# Altium schematic sheet AI_XiaoZhi_WIFI.SchDoc
size A3; SheetNumber: 1; SheetTotal: 1
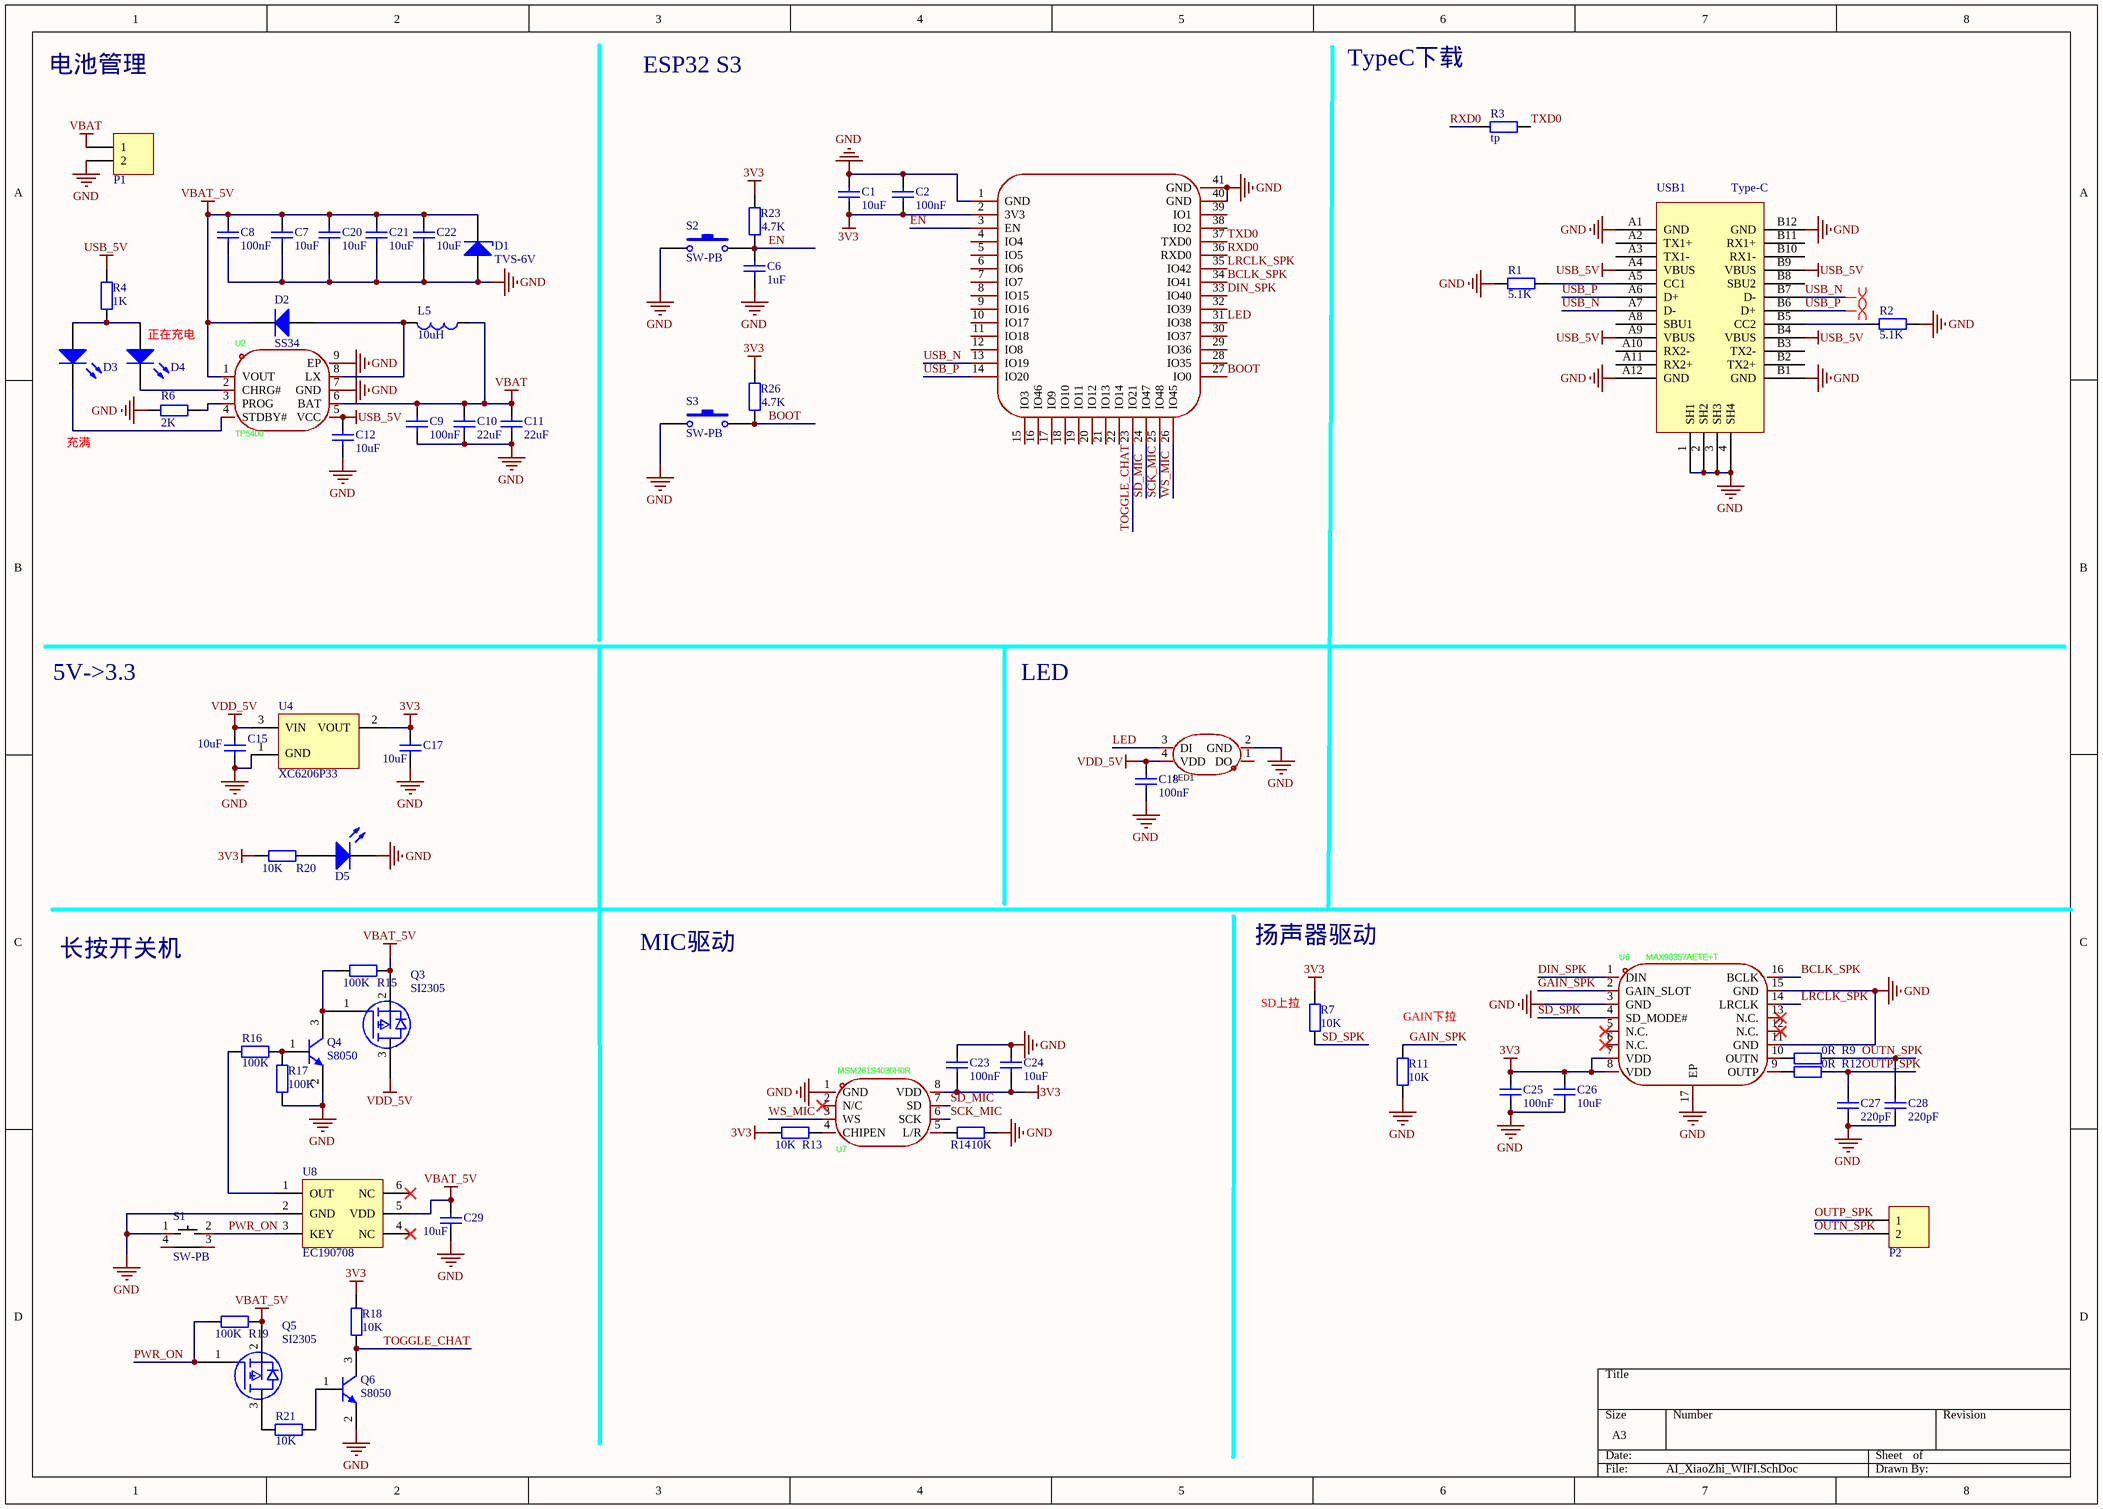
[diagram p0: AI_XiaoZhi_WIFI.SchDoc]

## Parts
C1  value 10uF  [0603-C]  (hidden comment: CAP)
C2  value 100nF  [0603-C]  (hidden comment: CAP)
C6  value 1uF  [0603-C]  (hidden comment: CAP)
C7  value 10uF  [0603-C]  (hidden comment: CAP)
C8  value 100nF  [0603-C]  (hidden comment: CAP)
C9  value 100nF  [0603-C]  (hidden comment: CAP)
C10  value 22uF  [0603-C]  (hidden comment: CAP)
C11  value 22uF  [0603-C]  (hidden comment: CAP)
C12  value 10uF  [0603-C]  (hidden comment: CAP)
C15  value 10uF  [0603-C]  (hidden comment: CAP)
C17  value 10uF  [0603-C]  (hidden comment: CAP)
C18  value 100nF  [0603-C]  (hidden comment: CAP)
C20  value 10uF  [0603-C]  (hidden comment: CAP)
C21  value 10uF  [0603-C]  (hidden comment: CAP)
C22  value 10uF  [0603-C]  (hidden comment: CAP)
C23  value 100nF  [0603-C]  (hidden comment: CAP)
C24  value 10uF  [0603-C]  (hidden comment: CAP)
C25  value 100nF  [0603-C]  (hidden comment: CAP)
C26  value 10uF  [0603-C]  (hidden comment: CAP)
C27  value 220pF  [0603-C]  (hidden comment: CAP)
C28  value 220pF  [0603-C]  (hidden comment: CAP)
C29  value 10uF  [0603-C]  (hidden comment: CAP)
D1  value TVS-6V  [DIODE-SMA]  (hidden comment: Diode-Z)
D2  Type: SS34  [DIODE-SMA]  (hidden comment: Diode)
D3  LED  [0603-LED]  (value not drawn)
D4  LED  [0603-LED]  (value not drawn)
D5  LED  [0603-LED]  (value not drawn)
L5  value 10uH  [SMD_L4.4-W4.2]  (hidden comment: Inductor)
LED1  XL-2020RGBC-WS2812B  [LED-SMD_4P-L2.0-W2.0-BR-1]  (value not drawn)
P1  Header 2  [CONN-SMD_2P-P1.25-HC-1.25-2PWT]  (value not drawn)
P2  Header 2  [CONN-SMD_2P-P1.25-HC-1.25-2PWT]  (value not drawn)
Q3  value SI2305  [SOT-23]  (hidden comment: PMOS)
Q4  S8050  [SOT-23]
Q5  value SI2305  [SOT-23]  (hidden comment: PMOS)
Q6  S8050  [SOT-23]
R1  value 5.1K  [0603-R]  (hidden comment: RES)
R2  value 5.1K  [0603-R]  (hidden comment: RES)
R3  value tp  [0603-R]  (hidden comment: RES)
R4  value 1K  [0603-R]  (hidden comment: RES)
R6  value 2K  [0603-R]  (hidden comment: RES)
R7  value 10K  [0603-R]  (hidden comment: RES)
R9  value 0R  [0603-R]  (hidden comment: RES)
R11  value 10K  [0603-R]  (hidden comment: RES)
R12  value 0R  [0603-R]  (hidden comment: RES)
R13  value 10K  [0603-R]  (hidden comment: RES)
R14  value 10K  [0603-R]  (hidden comment: RES)
R15  value 100K  [0603-R]  (hidden comment: RES)
R16  value 100K  [0603-R]  (hidden comment: RES)
R17  value 100K  [0603-R]  (hidden comment: RES)
R18  value 10K  [0603-R]  (hidden comment: RES)
R19  value 100K  [0603-R]  (hidden comment: RES)
R20  value 10K  [0603-R]  (hidden comment: RES)
R21  value 10K  [0603-R]  (hidden comment: RES)
R23  value 4.7K  [0603-R]  (hidden comment: RES)
R26  value 4.7K  [0603-R]  (hidden comment: RES)
S1  SW-PB  [SW_TS]
S2  SW-PB  [SW-SMD_L3.9-W3.0-P4.45]
S3  SW-PB  [SW-SMD_L3.9-W3.0-P4.45]
U2  TP5400  [ESOP-8]
U3  ESP32-S3-WROOM-1U-N16R8  [WIRELM-SMD_ESP32-S3-WROOM-1]  (value not drawn)
U4  XC6206P33  [SOT-23]
U6  MAX98357AETE+T  [TQFN-16]
U7  MSM261S4030H0R  [MIC-SMD_8P-L4.0-W3.0-P1.00-BR]
U8  EC190708  [SOT-23-6]
USB1  Type-C  [Type-C-TOP]

## Nets
3V3: C1.2 C2.2 C17.2 C23.1 C24.1 C25.1 C26.1 R7.2 R13.2 R18.1 R20.2 R23.2 R26.2 U3.2(3V3) U4.2(VOUT) U6.7(VDD) U6.8(VDD) U7.8(VDD)
GND: C1.1 C2.1 C6.2 C7.2 C8.2 C9.2 C10.2 C11.2 C12.2 C15.1 C17.1 C18.1 C20.2 C21.2 C22.2 C23.2 C24.2 C25.2 C26.2 C27.2 C28.2 C29.1 D1.1(A) D5.2(K) LED1.2(GND) P1.2 Q4.2(E) Q6.2(E) R1.2 R2.1 R6.2 R11.1 R14.2 R17.2 S1.1 S2.1 S3.1 U2.7(GND) U2.9(EP) U3.1(GND) U3.40(GND) U3.41(GND) U4.1(GND) U6.3(GND) U6.11(GND) U6.15(GND) U6.17(EP) U7.1(GND) U8.2(GND) USB1.1(SH1) USB1.2(SH2) USB1.3(SH3) USB1.4(SH4) USB1.A1(GND) USB1.A12(GND) USB1.B1(GND) USB1.B12(GND)
USB_5V: C12.1 R4.2 U2.5(VCC) USB1.A4(VBUS) USB1.A9(VBUS) USB1.B4(VBUS) USB1.B9(VBUS)
VBAT: C9.1 C10.1 C11.1 L5.1 P1.1 U2.6(BAT)
VBAT_5V: C7.1 C8.1 C20.1 C21.1 C22.1 C29.2 D1.2(K) D2.2(K) Q3.2(S) Q5.2(S) R15.1 R19.1 U2.1(VOUT) U8.5(VDD)
VDD_5V: C15.2 C18.2 LED1.4(VDD) Q3.3(D) U4.3(VIN)
BCLK_SPK: U3.34(IO41) U6.16(BCLK)
BOOT: R26.1 S3.2 U3.27(IO0)
DIN_SPK: U3.33(IO40) U6.1(DIN)
EN: C6.1 R23.1 S2.2 U3.3(EN)
GAIN_SPK: R11.2 U6.2(GAIN_SLOT)
LED: LED1.3(DI) U3.31(IO38)
LRCLK_SPK: U3.35(IO42) U6.14(LRCLK)
OUTN_SPK: C28.1 P2.2 R9.2
OUTP_SPK: C27.1 P2.1 R12.2
PWR_ON: Q5.1(G) R19.2 S1.2 U8.3(KEY)
RXD0: R3.1 U3.36(RXD0)
SCK_MIC: U3.25(IO48) U7.6(SCK)
SD_MIC: U3.24(IO47) U7.7(SD)
SD_SPK: R7.1 U6.4(SD_MODE#)
TOGGLE_CHAT: Q6.3(C) R18.2 U3.23(IO21)
TXD0: R3.2 U3.37(TXD0)
USB_N: U3.13(IO19) USB1.A7(D-) USB1.B7(D-)
USB_P: U3.14(IO20) USB1.A6(D+) USB1.B6(D+)
WS_MIC: U3.26(IO45) U7.3(WS)
NetD2_1: D2.1(A) L5.2 U2.8(LX)
NetD3_1: D3.1(A) D4.1(A) R4.1
NetD3_2: D3.2(K) U2.4(STDBY#)
NetD4_2: D4.2(K) U2.2(CHRG#)
NetD5_1: D5.1(A) R20.1
NetQ3_1: Q3.1(G) Q4.3(C) R15.2
NetQ4_1: Q4.1(B) R16.2 R17.1
NetQ5_3: Q5.3(D) R21.1
NetQ6_1: Q6.1(B) R21.2
NetR1_1: R1.1 USB1.A5(CC1)
NetR2_2: R2.2 USB1.B5(CC2)
NetR6_1: R6.1 U2.3(PROG)
NetR9_1: R9.1 U6.10(OUTN)
NetR12_1: R12.1 U6.9(OUTP)
NetR13_1: R13.1 U7.4(CHIPEN)
NetR14_1: R14.1 U7.5(L/R)
NetR16_1: R16.1 U8.1(OUT)

Not connected (* = marked no-connect by the designer): LED1 1(DO); S1 3 4; U3 4(IO4) 5(IO5) 6(IO6) 7(IO7) 8(IO15) 9(IO16) 10(IO17) 11(IO18) 12(IO8) 15(IO3) 16(IO46) 17(IO9) 18(IO10) 19(IO11) 20(IO12) 21(IO13) 22(IO14) 28(IO35) 29(IO36) 30(IO37) 32(IO39) 38(IO2) 39(IO1); U6 5(N.C.)* 6(N.C.)* 12(N.C.)* 13(N.C.)*; U7 2(N/C)*; U8 4(NC)* 6(NC)*; USB1 A2(TX1+) A3(TX1-) A8(SBU1) A10(RX2-) A11(RX2+) B2(TX2+) B3(TX2-) B8(SBU2) B10(RX1-) B11(RX1+)

## Layout directives
differential pair: USB_N, USB_P

## Notes on the sheet
- 电池管理
- ESP32 S3
- TypeC下载
- (near D4) 正在充电
- 充满
- 5V->3.3
- LED
- 长按开关机
- MIC驱动
- 扬声器驱动
- (near R7) SD上拉
- (near R11) GAIN下拉

## Library data of the parts
C1 C2 C6-C12 C15 C17 C18 C20-C29 = CAP: 无极性电容; Published: 8-Jun-2000; LatestRevisionDate: 17-Jul-2002; LatestRevisionNote: Re-released for DXP Platform.; PackageReference: RAD-0.3; Publisher: Altium Limited
D1 = Diode-Z: 稳压二极管; Published: 8-Jun-2000; LatestRevisionDate: 17-Jul-2002; LatestRevisionNote: Re-released for DXP Platform.; PackageReference: SMB; Publisher: Altium Limited; Code_JEDEC: DO-214-AA
D2 = Diode: 二极管; Published: 8-Jun-2000; LatestRevisionDate: 17-Jul-2002; LatestRevisionNote: Re-released for DXP Platform.; PackageDocument: Sep-1996; PackageReference: SMC; Publisher: Altium Limited; Code_JEDEC: DO-214-AB
D3-D5 = LED: 发光二极管; Published: 8-Jun-2000; LatestRevisionDate: 08-Jul-2005; LatestRevisionNote: Mech Layer 1 removed.; PackageReference: LED-0; Publisher: Altium Limited
L5 = Inductor: 电感; Code_IEC: 1005; Published: 8-Jun-2000; LatestRevisionDate: 17-Jul-2002; LatestRevisionNote: Re-released for DXP Platform.; PackageReference: 0402-A; Publisher: Altium Limited; Code_JEITA: 0402
LED1 = XL-2020RGBC-WS2812B: Manufacturer: XINGLIGHT(成兴光); Add into BOM: yes; Symbol: XL-2020RGBC-WS2812B; Device: XL-2020RGBC-WS2812B; LCSC Part Name: 幻彩透明; Supplier Part: C5349955; Manufacturer Part: XL-2020RGBC-WS2812B; Supplier Footprint: 2020; JLCPCB Part Class: Extended Part; Datasheet: https://atta.szlcsc.com/upload/public/pdf/source/20230111/97A2D5930F183799801175706AF118AF.pdf; Supplier: LCSC; Convert to PCB: yes
P1 P2 = Header 2: 接插件; LatestRevisionDate: 17-Jul-2002; LatestRevisionNote: Re-released for DXP Platform.; Publisher: Altium Limited
Q3 Q5 = PMOS: PNP MOS管; PackageDocument: 1995/1996; Published: 8-Jun-2000; LatestRevisionDate: 17-Jul-2002; LatestRevisionNote: Re-released for DXP Platform.; PackageReference: E3; Publisher: Altium Limited
Q4 Q6 = NPN_BJT: NPN三极管; Published: 8-Jun-2000; LatestRevisionDate: 15-Jan-2003; LatestRevisionNote: PCB Footprint 'BCY-W3/D4.7' replaced; DatasheetDocument: 1997; PackageDocument: Sep-1998; PackageReference: TO-92A; Publisher: Altium Limited; Code_JEDEC: TO-92A; ComponentLink1Description: Manufacturer Link; ComponentLink1URL: http://www.fairchildsemi.com/; ComponentLink2Description: Datasheet; ComponentLink2URL: http://www.fairchildsemi.com/ds/2N%2F2N3904.pdf
R1-R4 R6 R7 R9 R11-R21 R23 R26 = RES: 贴片电阻; Published: 8-Jun-2000; LatestRevisionDate: 17-Jul-2002; LatestRevisionNote: Re-released for DXP Platform.; PackageReference: AXIAL-0.4; Publisher: Altium Limited
S1 = SW-TS: 微动开关; Published: 24-Mar-1999; LatestRevisionDate: 17-Jul-2002; LatestRevisionNote: Re-released for DXP Platform.; PackageReference: SPST-2; Publisher: Altium Limited
S2 S3 = SW-PB: 微动开关; Published: 24-Mar-1999; LatestRevisionDate: 17-Jul-2002; LatestRevisionNote: Re-released for DXP Platform.; PackageReference: SPST-2; Publisher: Altium Limited
U2 = TP5400: 单节锂电池充电管理模块; Manufacturer: TOPPOWER(南京拓微); Symbol: TP5400_C2891434; Add into BOM: yes; Device: TP5400; LCSC Part Name: TP5400; Supplier Part: C2891434; Manufacturer Part: TP5400; Supplier Footprint: ESOP-8; JLCPCB Part Class: Extended Part; Datasheet: https://atta.szlcsc.com/upload/public/pdf/source/20210909/352D9D40D77A1DD73F7904E364EF004B.pdf; Supplier: LCSC; Convert to PCB: yes
U3 = ESP32-S3-WROOM-1U-N16R8: Manufacturer: ESPRESSIF(乐鑫); Add into BOM: yes; Symbol: ESP32-S3-WROOM-1U-N16R8; Device: ESP32-S3-WROOM-1U-N16R8; LCSC Part Name: ESP32-S3-WROOM-1U-N16R8; Supplier Part: C3013946; Manufacturer Part: ESP32-S3-WROOM-1U-N16R8; Supplier Footprint: SMD,18x19.2mm; JLCPCB Part Class: Extended Part; Datasheet: https://atta.szlcsc.com/upload/public/pdf/source/20240130/9D71F4DF55874C504AB629FEEE3F038E.pdf; Supplier: LCSC; Convert to PCB: yes
U4 = XC6206PXXX: LDO稳压芯片
U6 = MAX98357AETE+T: 扬声器驱动芯片; Manufacturer: ADI(亚德诺)/MAXIM(美信); Add into BOM: yes; Speaker Channels: 单声道; Output Power: 3.2Wx2@4Ω; Supply Voltage: 2.5V~5.5V; Symbol: MAX98357AETE+T; Device: MAX98357AETE+T; LCSC Part Name: 微型、低成本、PCM 类 D 级放大器具有 AB 级性能; Supplier Part: C910544; Manufacturer Part: MAX98357AETE+T; Supplier Footprint: TQFN-16-EP(3x3); JLCPCB Part Class: Extended Part; Datasheet: https://atta.szlcsc.com/upload/public/pdf/source/20210106/C910544_CB6DE4B2CEE254A72E6BDB40E718D281.pdf; Supplier: LCSC; Convert to PCB: yes; Type of Power Amplifier: -; Operating Temperature: -40℃~+85℃
U7 = MIC: Manufacturer: MEMS(敏芯微); Add into BOM: yes; Symbol: MSM261S4030H0R; Device: MSM261S4030H0R; LCSC Part Name: MSM261S4030H0R; Supplier Part: C2840615; Manufacturer Part: MSM261S4030H0R; Supplier Footprint: -; JLCPCB Part Class: Extended Part; Datasheet: https://atta.szlcsc.com/upload/public/pdf/source/20210707/C2840615_6AE5BCBEE3224C96A8195D5DC270E7C8.pdf; Supplier: LCSC; Convert to PCB: yes
U8 = EC190708: 长按开关机
USB1 = USB-Type-C-TOP: 16Pins TYPEC